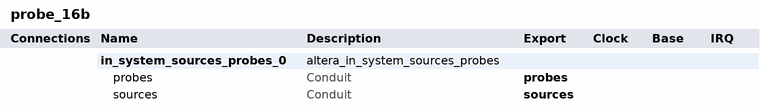
[diagram p0: system contents]
# Platform Designer (Qsys) system probe_16b, MAX 10 10M40DCF256C7G
# Parameters at their usual value, and those the tool derives, are not listed.
package require -exact qsys 17.1
create_system probe_16b
set_project_property DEVICE_FAMILY {MAX 10}
set_project_property DEVICE 10M40DCF256C7G

add_instance in_system_sources_probes_0 altera_in_system_sources_probes 17.1
set_instance_property in_system_sources_probes_0 AUTO_EXPORT true
set_instance_parameter_value in_system_sources_probes_0 create_source_clock false
set_instance_parameter_value in_system_sources_probes_0 instance_id PB16
set_instance_parameter_value in_system_sources_probes_0 probe_width 16
set_instance_parameter_value in_system_sources_probes_0 source_width 16

# exported interfaces
add_interface probes conduit end
set_interface_property probes EXPORT_OF in_system_sources_probes_0.probes
add_interface sources conduit end
set_interface_property sources EXPORT_OF in_system_sources_probes_0.sources

set_interconnect_requirement {$system} qsys_mm.clockCrossingAdapter HANDSHAKE
set_interconnect_requirement {$system} qsys_mm.enableEccProtection FALSE
set_interconnect_requirement {$system} qsys_mm.insertDefaultSlave FALSE
set_interconnect_requirement {$system} qsys_mm.maxAdditionalLatency 1

save_system probe_16b.qsys
